# EAGLE schematic Rear Board v38 (EAGLE 9.7.0)
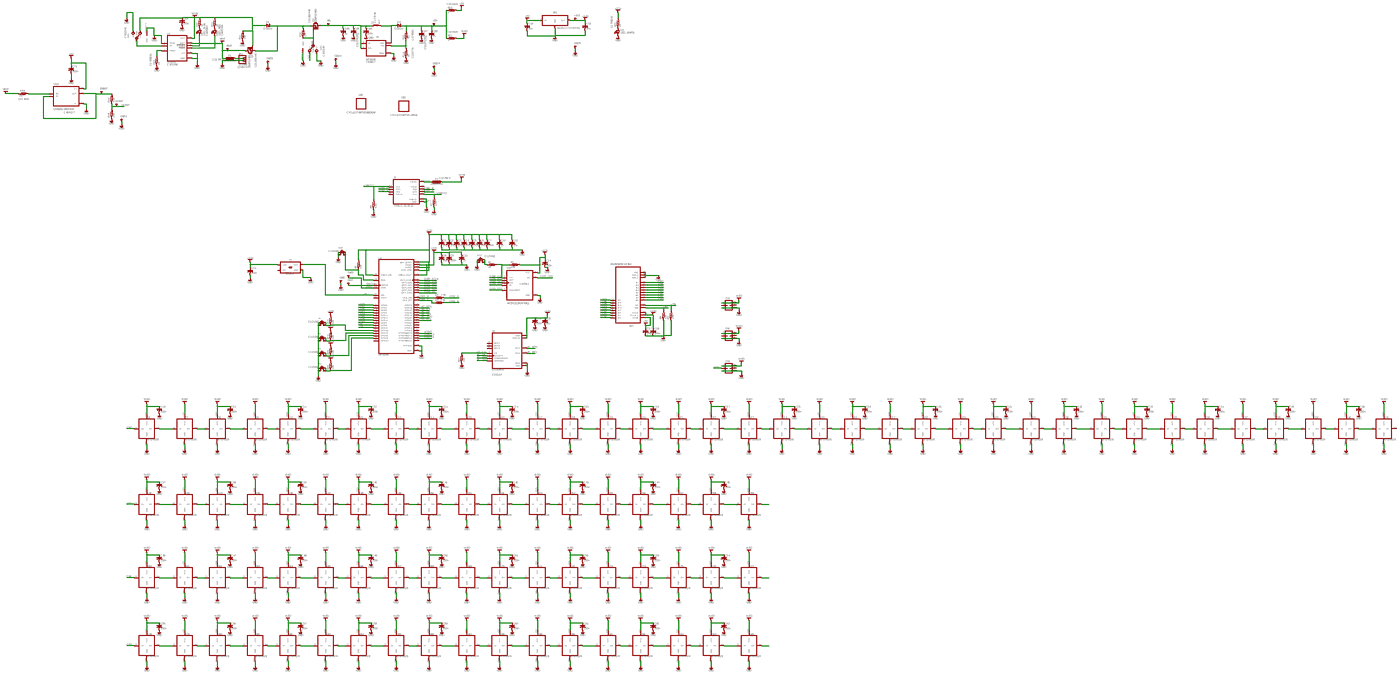
[diagram p0: schematic, sheet 1, overview]
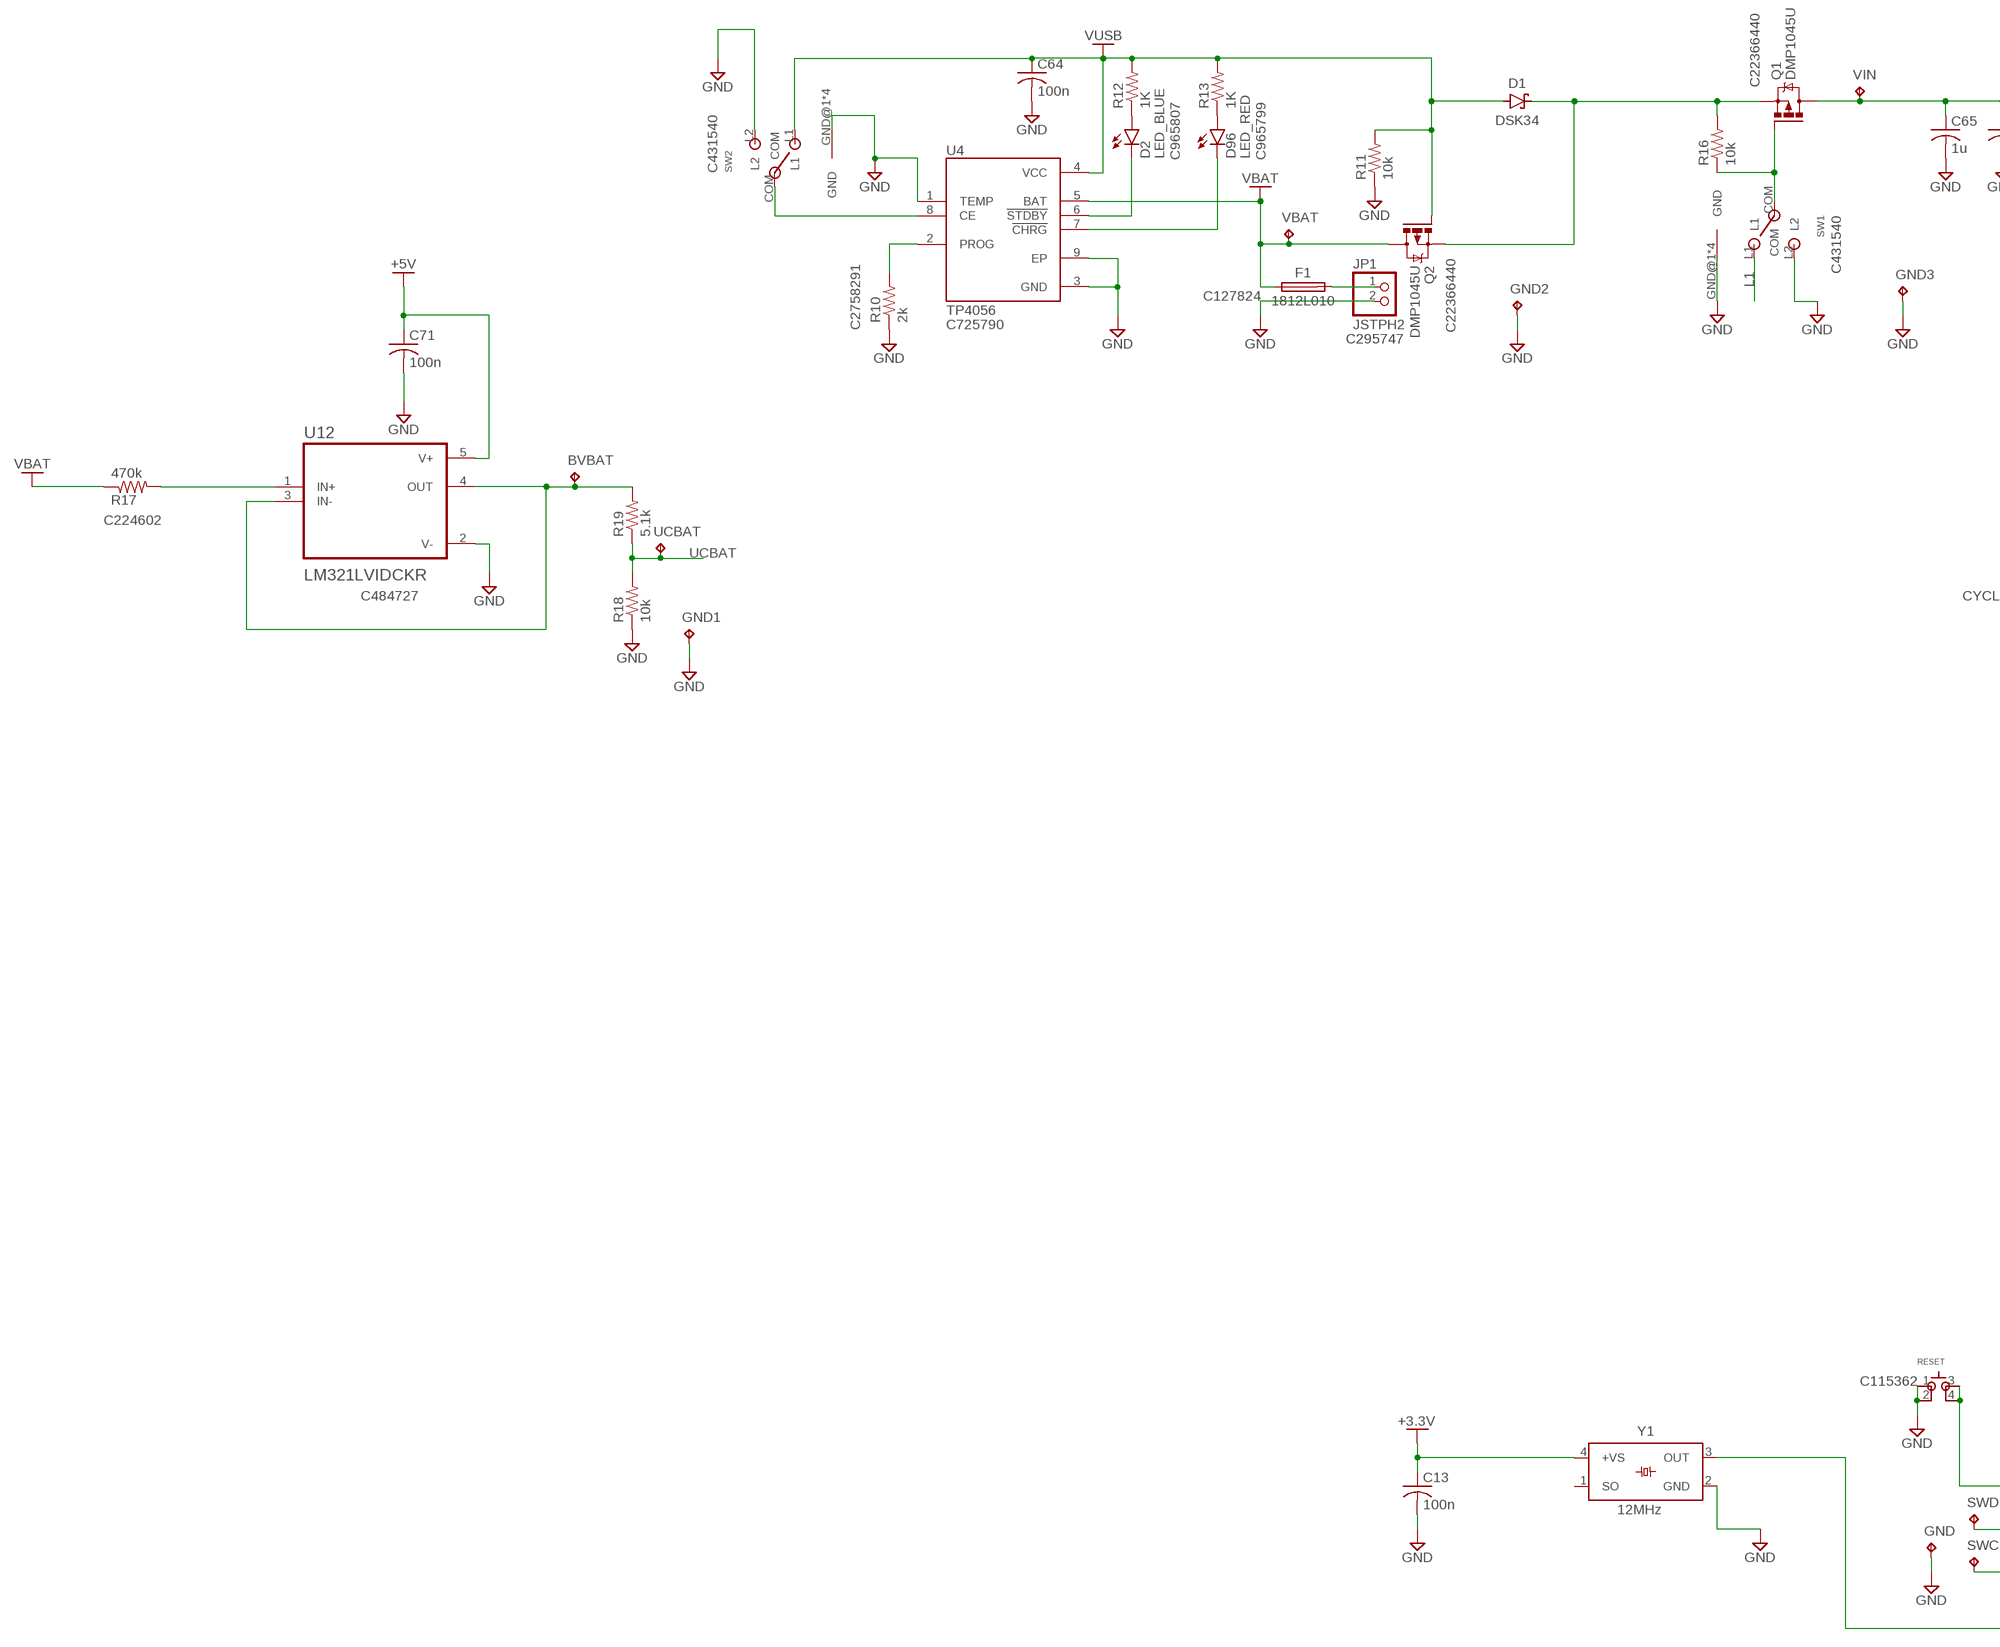
[diagram p1: schematic, sheet 1, part 1 of 6]
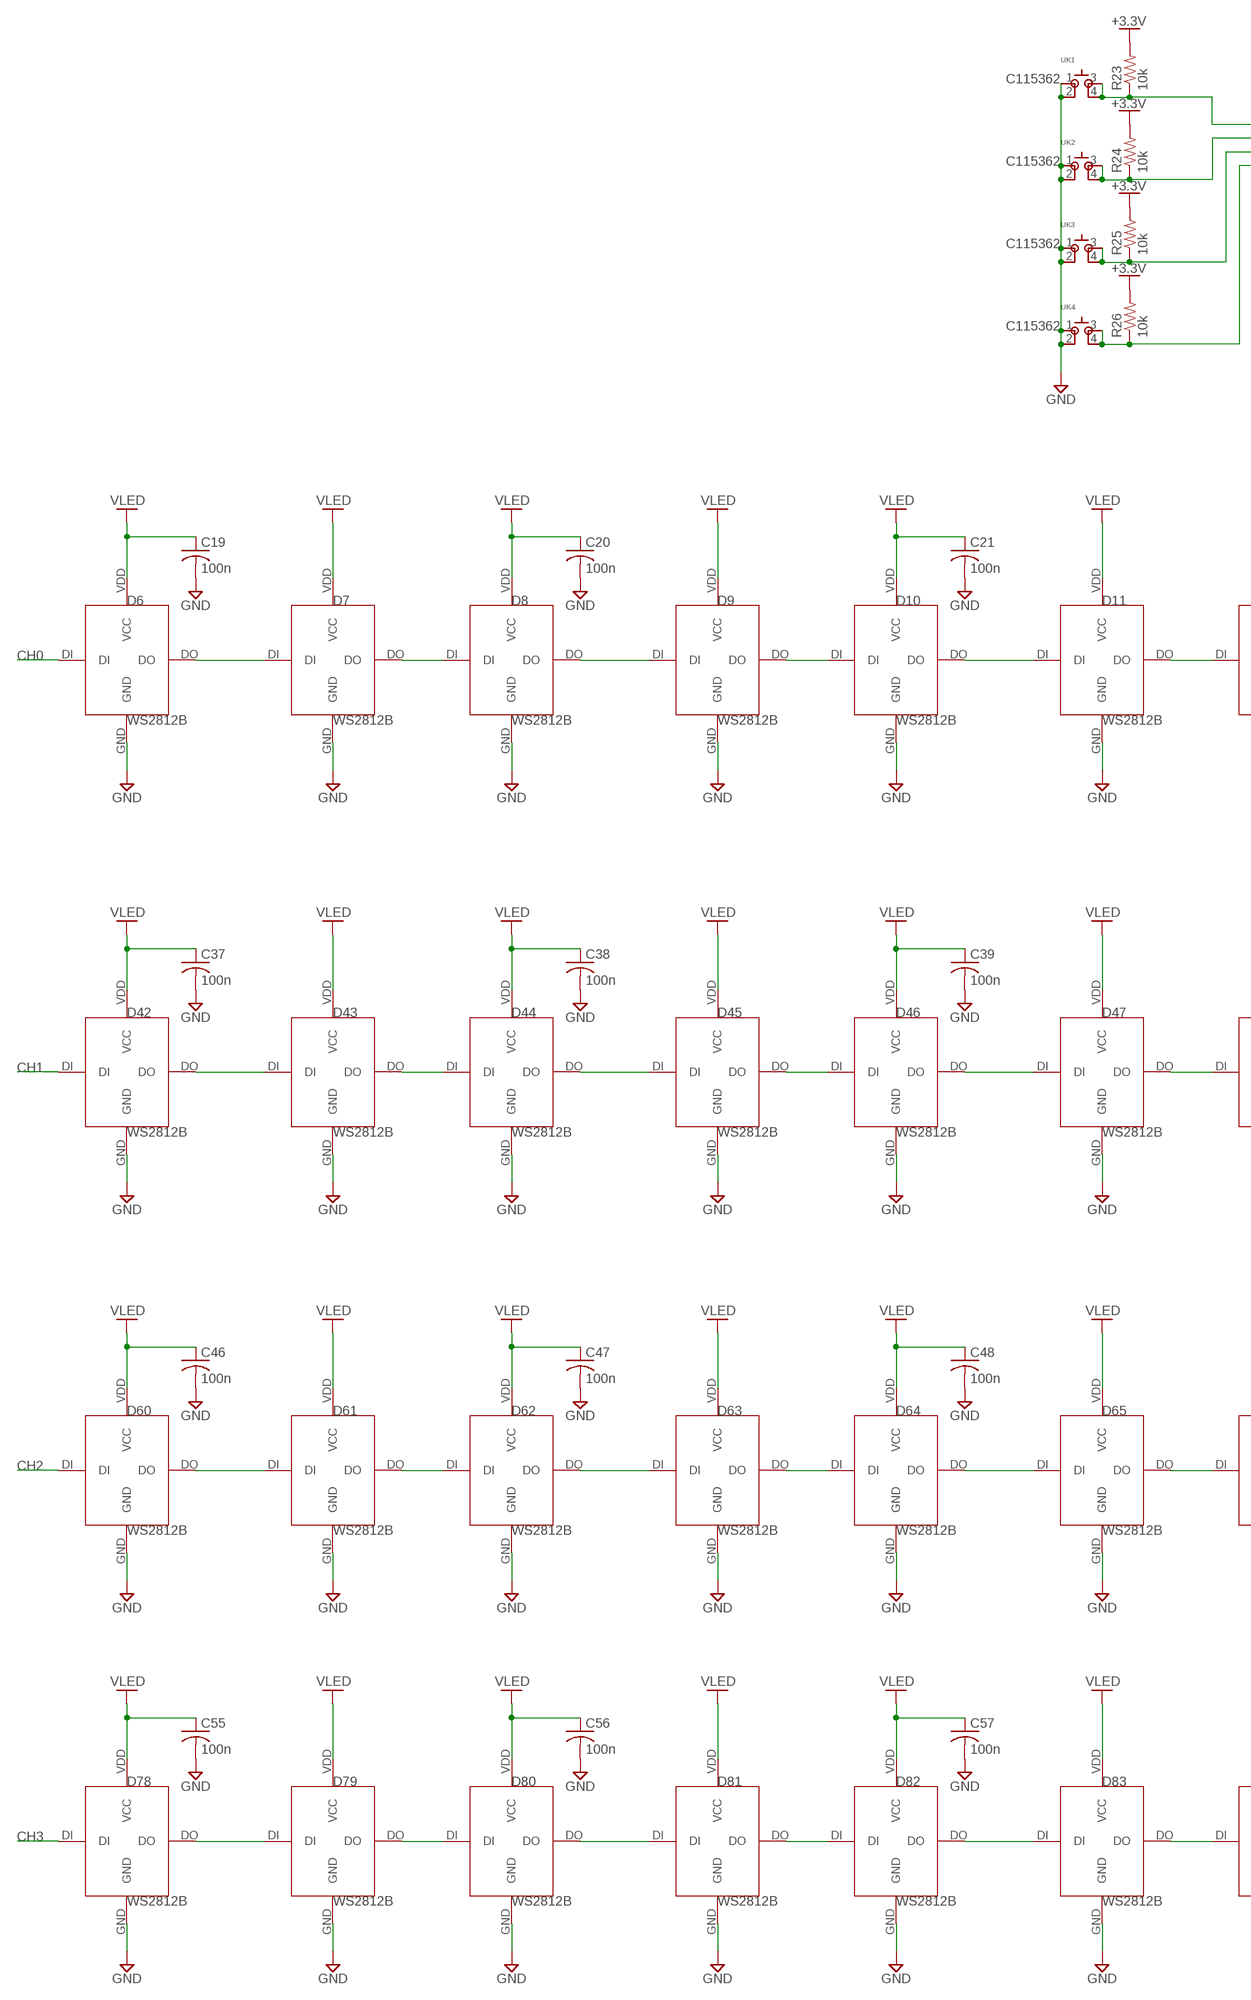
[diagram p2: schematic, sheet 1, part 2 of 6]
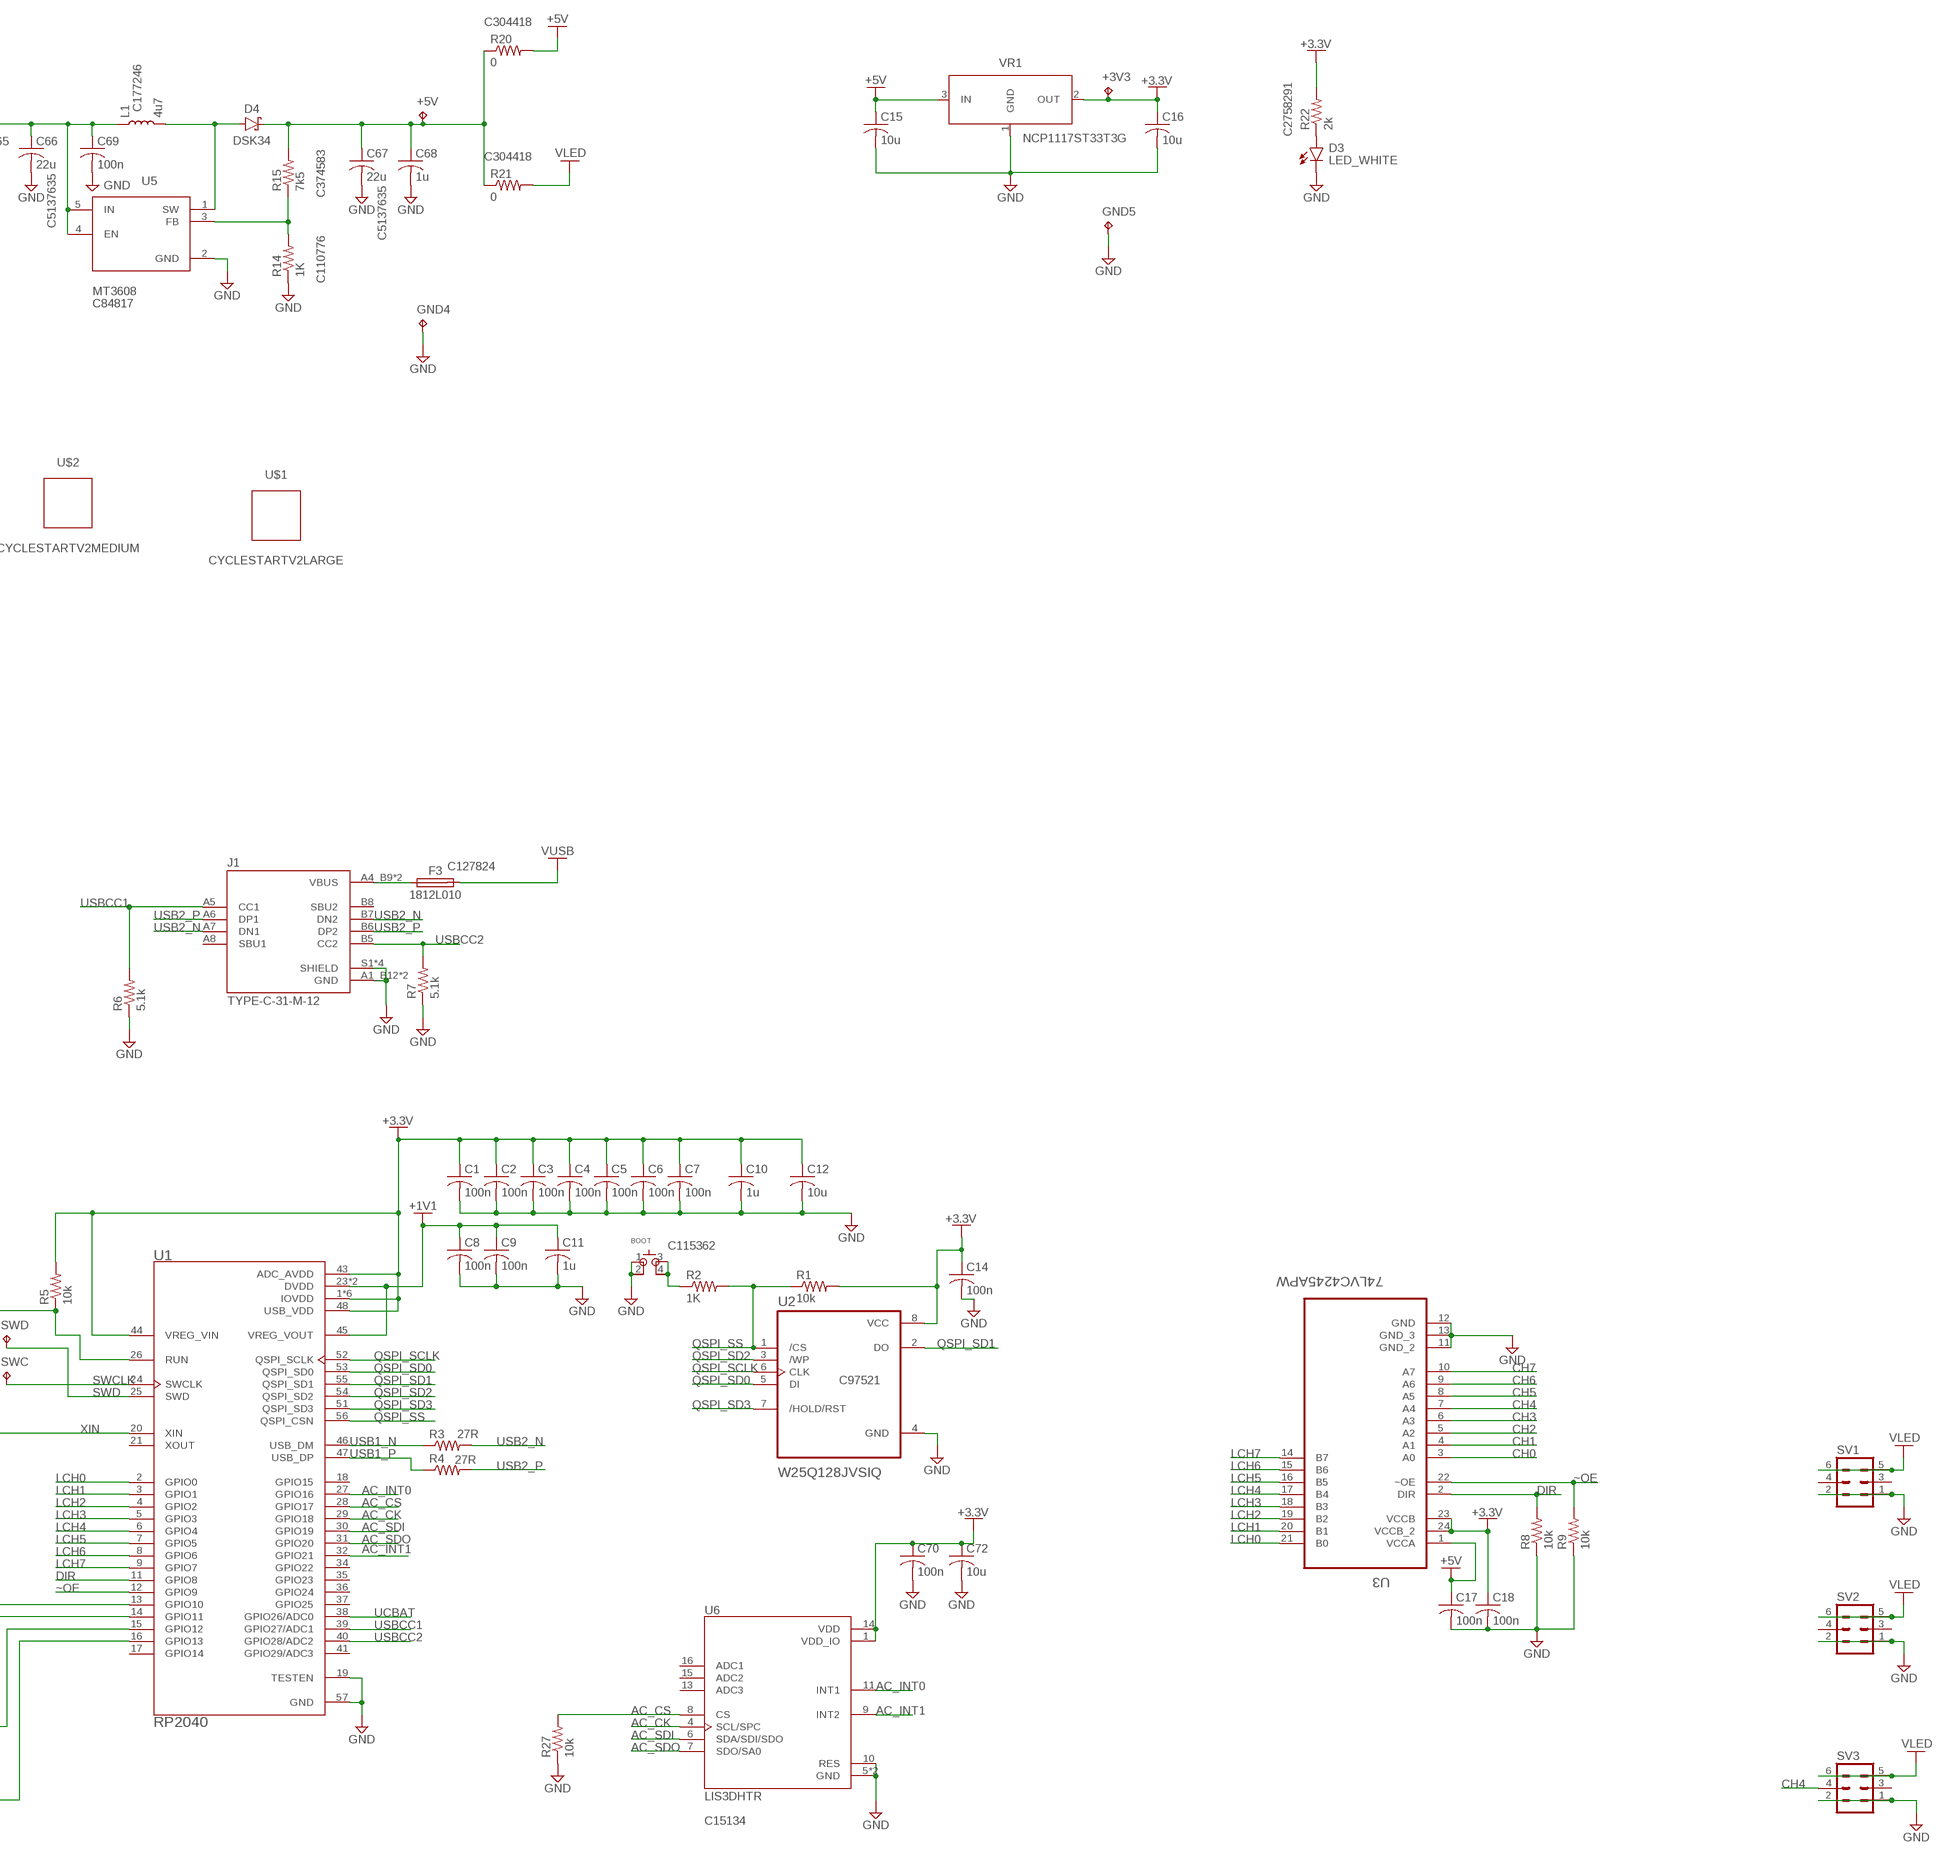
[diagram p3: schematic, sheet 1, part 3 of 6]
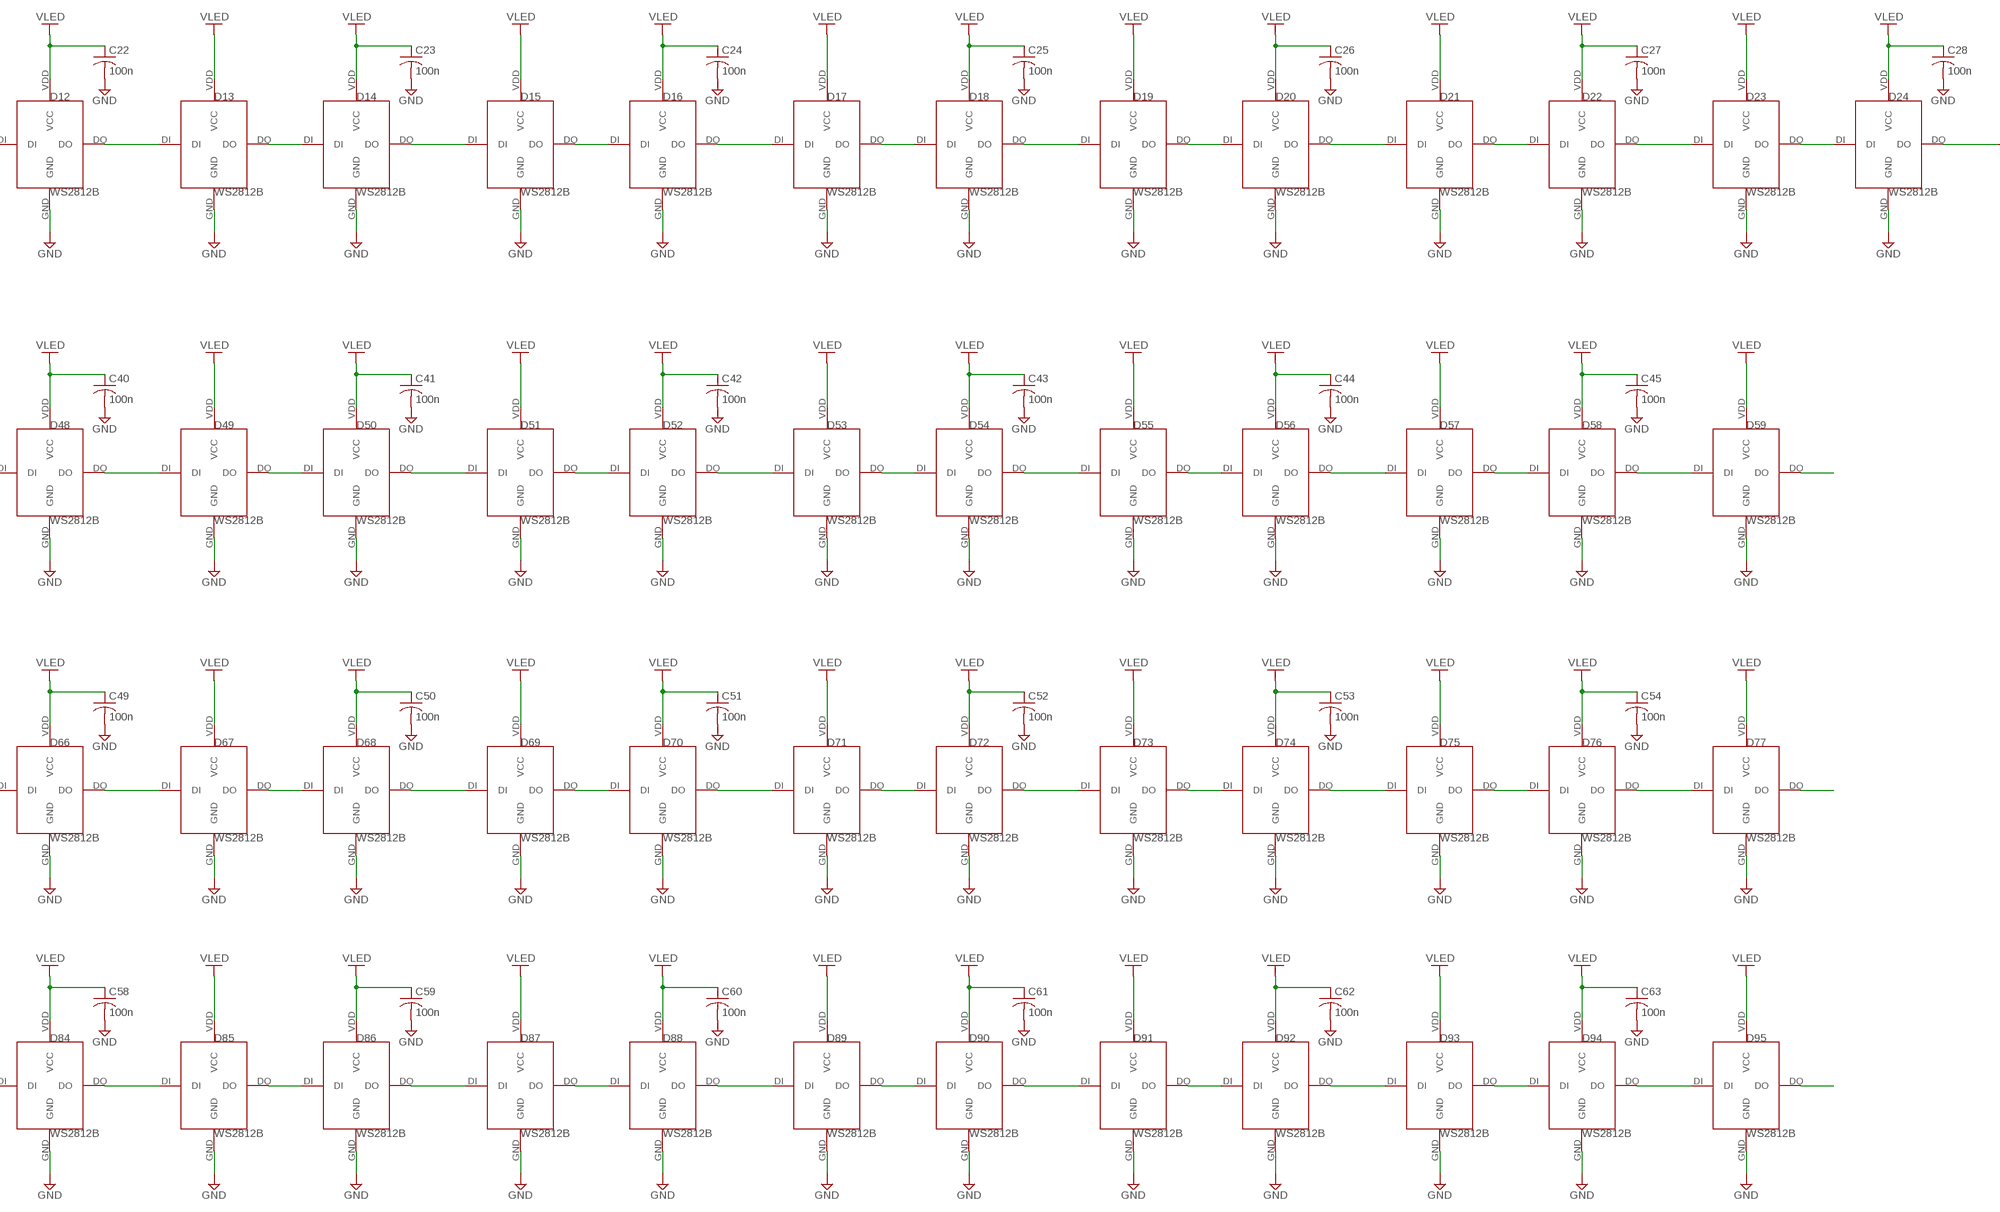
[diagram p4: schematic, sheet 1, part 4 of 6]
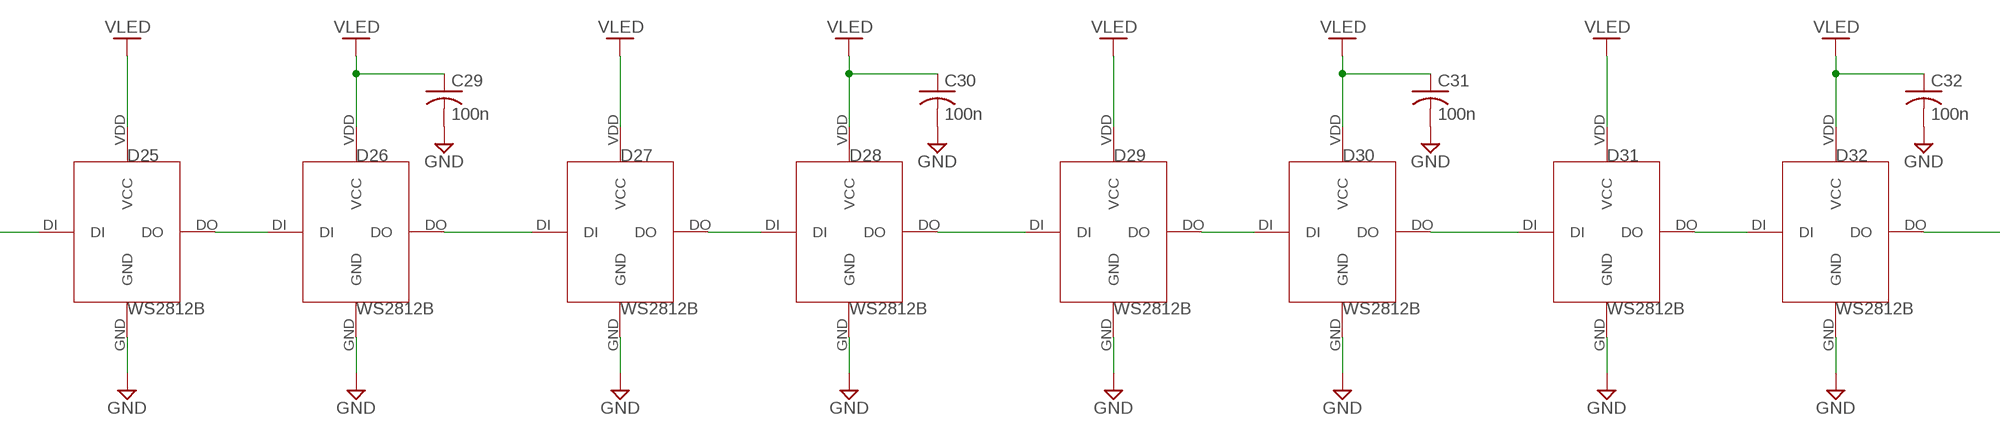
[diagram p5: schematic, sheet 1, part 5 of 6]
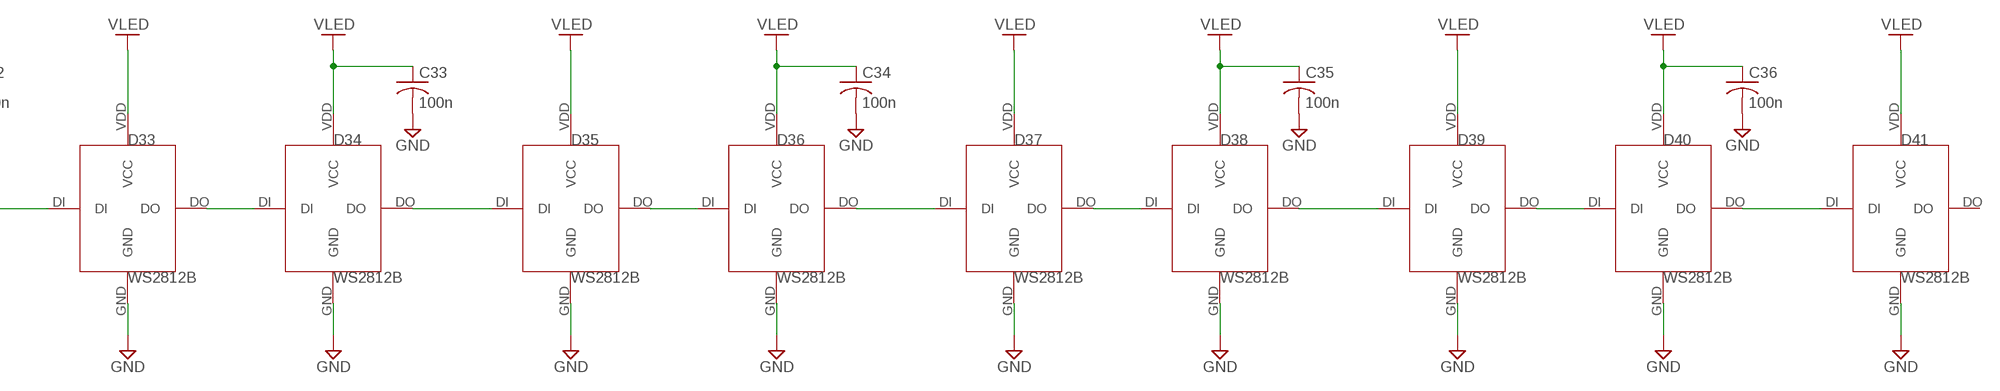
[diagram p6: schematic, sheet 1, part 6 of 6]

## Parts
+3V3  TPB2,54  [B2,54]
+5V  TPB2,54  [B2,54]
BOOT  SKSCLDE010  [SKSCLDE010]
BVBAT  TPB2,54  [B2,54]
C1  100n  C-USC0603  [C0603]
C2  100n  C-USC0603  [C0603]
C3  100n  C-USC0603  [C0603]
C4  100n  C-USC0603  [C0603]
C5  100n  C-USC0603  [C0603]
C6  100n  C-USC0603  [C0603]
C7  100n  C-USC0603  [C0603]
C8  100n  C-USC0603  [C0603]
C9  100n  C-USC0603  [C0603]
C10  1u  C-USC0603  [C0603]
C11  1u  C-USC0603  [C0603]
C12  10u  C-USC0603  [C0603]
C13  100n  C-USC0603  [C0603]
C14  100n  C-USC0603  [C0603]
C15  10u  C-USC0603  [C0603]
C16  10u  C-USC0603  [C0603]
C17  100n  C-USC0603  [C0603]
C18  100n  C-USC0603  [C0603]
C19  100n  C-USC0603K  [C0603K]
C20  100n  C-USC0603K  [C0603K]
C21  100n  C-USC0603K  [C0603K]
C22  100n  C-USC0603K  [C0603K]
C23  100n  C-USC0603K  [C0603K]
C24  100n  C-USC0603K  [C0603K]
C25  100n  C-USC0603K  [C0603K]
C26  100n  C-USC0603K  [C0603K]
C27  100n  C-USC0603K  [C0603K]
C28  100n  C-USC0603K  [C0603K]
C29  100n  C-USC0603K  [C0603K]
C30  100n  C-USC0603K  [C0603K]
C31  100n  C-USC0603K  [C0603K]
C32  100n  C-USC0603K  [C0603K]
C33  100n  C-USC0603K  [C0603K]
C34  100n  C-USC0603K  [C0603K]
C35  100n  C-USC0603K  [C0603K]
C36  100n  C-USC0603K  [C0603K]
C37  100n  C-USC0603K  [C0603K]
C38  100n  C-USC0603K  [C0603K]
C39  100n  C-USC0603K  [C0603K]
C40  100n  C-USC0603K  [C0603K]
C41  100n  C-USC0603K  [C0603K]
C42  100n  C-USC0603K  [C0603K]
C43  100n  C-USC0603K  [C0603K]
C44  100n  C-USC0603K  [C0603K]
C45  100n  C-USC0603K  [C0603K]
C46  100n  C-USC0603K  [C0603K]
C47  100n  C-USC0603K  [C0603K]
C48  100n  C-USC0603K  [C0603K]
C49  100n  C-USC0603K  [C0603K]
C50  100n  C-USC0603K  [C0603K]
C51  100n  C-USC0603K  [C0603K]
C52  100n  C-USC0603K  [C0603K]
C53  100n  C-USC0603K  [C0603K]
C54  100n  C-USC0603K  [C0603K]
C55  100n  C-USC0603K  [C0603K]
C56  100n  C-USC0603K  [C0603K]
C57  100n  C-USC0603K  [C0603K]
C58  100n  C-USC0603K  [C0603K]
C59  100n  C-USC0603K  [C0603K]
C60  100n  C-USC0603K  [C0603K]
C61  100n  C-USC0603K  [C0603K]
C62  100n  C-USC0603K  [C0603K]
C63  100n  C-USC0603K  [C0603K]
C64  100n  C-USC0603  [C0603]
C65  1u  C-USC0603  [C0603]
C66  22u  C-USC1206K  [C1206K]
C67  22u  C-USC1206K  [C1206K]
C68  1u  C-USC0603  [C0603]
C69  100n  C-USC0603  [C0603]
C70  100n  C-USC0603  [C0603]
C71  100n  C-USC0603  [C0603]
C72  10u  C-USC0603  [C0603]
D1  DSK34  SCHOTTKY_MBR0520LT1GDO-219  [SODFL3718X115]
D2  LED_BLUE  CHIP-FLAT-B_0603-0.35MM  [LEDC1608X35N_FLAT-B]
D3  LED_WHITE  CHIP-FLAT-B_0603-0.35MM  [LEDC1608X35N_FLAT-B]
D4  DSK34  SCHOTTKY_MBR0520LT1GDO-219  [SODFL3718X115]
D6  WS2812B  [1010]
D7  WS2812B  [1010]
D8  WS2812B  [1010]
D9  WS2812B  [1010]
D10  WS2812B  [1010]
D11  WS2812B  [1010]
D12  WS2812B  [1010]
D13  WS2812B  [1010]
D14  WS2812B  [1010]
D15  WS2812B  [1010]
D16  WS2812B  [1010]
D17  WS2812B  [1010]
D18  WS2812B  [1010]
D19  WS2812B  [1010]
D20  WS2812B  [1010]
D21  WS2812B  [1010]
D22  WS2812B  [1010]
D23  WS2812B  [1010]
D24  WS2812B  [1010]
D25  WS2812B  [1010]
D26  WS2812B  [1010]
D27  WS2812B  [1010]
D28  WS2812B  [1010]
D29  WS2812B  [1010]
D30  WS2812B  [1010]
D31  WS2812B  [1010]
D32  WS2812B  [1010]
D33  WS2812B  [1010]
D34  WS2812B  [1010]
D35  WS2812B  [1010]
D36  WS2812B  [1010]
D37  WS2812B  [1010]
D38  WS2812B  [1010]
D39  WS2812B  [1010]
D40  WS2812B  [1010]
D41  WS2812B  [1010]
D42  WS2812B  [1010]
D43  WS2812B  [1010]
D44  WS2812B  [1010]
D45  WS2812B  [1010]
D46  WS2812B  [1010]
D47  WS2812B  [1010]
D48  WS2812B  [1010]
D49  WS2812B  [1010]
D50  WS2812B  [1010]
D51  WS2812B  [1010]
D52  WS2812B  [1010]
D53  WS2812B  [1010]
D54  WS2812B  [1010]
D55  WS2812B  [1010]
D56  WS2812B  [1010]
D57  WS2812B  [1010]
D58  WS2812B  [1010]
D59  WS2812B  [1010]
D60  WS2812B  [1010]
D61  WS2812B  [1010]
D62  WS2812B  [1010]
D63  WS2812B  [1010]
D64  WS2812B  [1010]
D65  WS2812B  [1010]
D66  WS2812B  [1010]
D67  WS2812B  [1010]
D68  WS2812B  [1010]
D69  WS2812B  [1010]
D70  WS2812B  [1010]
D71  WS2812B  [1010]
D72  WS2812B  [1010]
D73  WS2812B  [1010]
D74  WS2812B  [1010]
D75  WS2812B  [1010]
D76  WS2812B  [1010]
D77  WS2812B  [1010]
D78  WS2812B  [1010]
D79  WS2812B  [1010]
D80  WS2812B  [1010]
D81  WS2812B  [1010]
D82  WS2812B  [1010]
D83  WS2812B  [1010]
D84  WS2812B  [1010]
D85  WS2812B  [1010]
D86  WS2812B  [1010]
D87  WS2812B  [1010]
D88  WS2812B  [1010]
D89  WS2812B  [1010]
D90  WS2812B  [1010]
D91  WS2812B  [1010]
D92  WS2812B  [1010]
D93  WS2812B  [1010]
D94  WS2812B  [1010]
D95  WS2812B  [1010]
D96  LED_RED  CHIP-FLAT-B_0603-0.35MM  [LEDC1608X35N_FLAT-B]
F1  1812L010  [FUSC4532X125]
F3  1812L010  [FUSC4532X125]
GND  TPB2,54  [B2,54]
GND1  TPB2,54  [B2,54]
GND2  TPB2,54  [B2,54]
GND3  TPB2,54  [B2,54]
GND4  TPB2,54  [B2,54]
GND5  TPB2,54  [B2,54]
J1  TYPE-C-31-M-12  [HRO_TYPE-C-31-M-12]
JP1  JSTPH2  [JSTPH2]
L1  4u7  2.2μH_SHIELDED_INDUCTOR_5X5  [INDUCTOR_5X5MM]
Q1  DMP1045U  PMOSFET_IRLML5203_SOT23-GSD  [SOT23]
Q2  DMP1045U  PMOSFET_IRLML5203_SOT23-GSD  [SOT23]
R1  10k  R-US_R0603  [R0603]
R2  1K  R-US_R0603  [R0603]
R3  27R  R-US_R0603  [R0603]
R4  27R  R-US_R0603  [R0603]
R5  10k  R-US_R0603  [R0603]
R6  5.1k  R-US_R0603  [R0603]
R7  5.1k  R-US_R0603  [R0603]
R8  10k  R-US_R0603  [R0603]
R9  10k  R-US_R0603  [R0603]
R10  2k  R-US_R0603  [R0603]
R11  10k  R-US_R0603  [R0603]
R12  1K  R-US_R0603  [R0603]
R13  1K  R-US_R0603  [R0603]
R14  1K  R-US_R0603  [R0603]
R15  7k5  R-US_R0603  [R0603]
R16  10k  R-US_R0603  [R0603]
R17  470k  R-US_R0603  [R0603]
R18  10k  R-US_R0603  [R0603]
R19  5.1k  R-US_R0603  [R0603]
R20  0  R-US_R1206  [R1206]
R21  0  R-US_R1206  [R1206]
R22  2k  R-US_R0603  [R0603]
R23  10k  R-US_R0603  [R0603]
R24  10k  R-US_R0603  [R0603]
R25  10k  R-US_R0603  [R0603]
R26  10k  R-US_R0603  [R0603]
R27  10k  R-US_R0603  [R0603]
RESET  SKSCLDE010  [SKSCLDE010]
SV1  MA03-2  [MA03-2]
SV2  MA03-2  [MA03-2]
SV3  MA03-2  [MA03-2]
SW1  MSK-12C02_SMD_SPDT_SWITCH  [MSK-12C02]
SW2  MSK-12C02_SMD_SPDT_SWITCH  [MSK-12C02]
SWC  TPB2,54  [B2,54]
SWD  TPB2,54  [B2,54]
U1  RP2040  [QFN40P700X700X90-57N]
U2  W25Q128JVSIQ  W25Q64JVSSIQ  [SOIC127P790X216-8N]
U3  74LVC4245APW  [SOP65P640X110-24N]
U4  TP4056  [SOP127P600X175-9N]
U5  MT3608  [SOT95P280X145-6N]
U6  LIS3DHTR  [XDCR_LIS3DHTR]
U12  LM321LVIDCKR  [SOT65P210X110-5N]
U$1  CYCLESTARTV2LARGE  [CYCLESTARTV2LARGE]
U$2  CYCLESTARTV2MEDIUM  [CYCLESTARTV2MEDIUM]
UCBAT  TPB2,54  [B2,54]
UK1  SKSCLDE010  [SKSCLDE010]
UK2  SKSCLDE010  [SKSCLDE010]
UK3  SKSCLDE010  [SKSCLDE010]
UK4  SKSCLDE010  [SKSCLDE010]
VBAT  TPB2,54  [B2,54]
VIN  TPB2,54  [B2,54]
VR1  NCP1117ST33T3G  NCP1117ST33T3GSOT-223  [SOT230P700X170-4]
Y1  12MHz  WE-SPXO_IQXO-540_830208214609  [WE-SPXO_IQXO-540]

## Nets
+1V1: C8.1 C9.1 C11.1 U1.23(DVDD) U1.45(VREG_VOUT) U1.50(DVDD)
+3.3V: +3V3.TP C1.1 C2.1 C3.1 C4.1 C5.1 C6.1 C7.1 C10.1 C12.1 C13.1 C14.1 C16.1 C18.1 C70.1 C72.1 R1.2 R5.2 R22.2 R23.2 R24.2 R25.2 R26.2 U1.1(IOVDD) U1.10(IOVDD) U1.22(IOVDD) U1.33(IOVDD) U1.42(IOVDD) U1.43(ADC_AVDD) U1.44(VREG_VIN) U1.48(USB_VDD) U1.49(IOVDD) U2.8(VCC) U3.23(VCCB) U3.24(VCCB_2) U6.1(VDD_IO) U6.14(VDD) VR1.2(OUT) Y1.4(+VS)
+5V: C15.1 C17.1 C71.1 R20.2 U3.1(VCCA) U12.5(V+) VR1.3(IN)
AC_CK: U1.29(GPIO18) U6.4(SCL/SPC)
AC_CS: R27.2 U1.28(GPIO17) U6.8(CS)
AC_INT0: U1.27(GPIO16) U6.11(INT1)
AC_INT1: U1.32(GPIO21) U6.9(INT2)
AC_SDI: U1.30(GPIO19) U6.6(SDA/SDI/SDO)
AC_SDO: U1.31(GPIO20) U6.7(SDO/SA0)
AMP7: BVBAT.TP R19.2 U12.3(IN-) U12.4(OUT)
CH0: D6.DI U3.3(A0)
CH1: D42.DI U3.4(A1)
CH2: D60.DI U3.5(A2)
CH3: D78.DI U3.6(A3)
CH4: SV3.4 U3.7(A4)
CH5: U3.8(A5)
CH6: U3.9(A6)
CH7: U3.10(A7)
DIR: R8.2 U1.11(GPIO8) U3.2(DIR)
GND: BOOT.1 BOOT.2 C1.2 C2.2 C3.2 C4.2 C5.2 C6.2 C7.2 C8.2 C9.2 C10.2 C11.2 C12.2 C13.2 C14.2 C15.2 C16.2 C17.2 C18.2 C19.2 C20.2 C21.2 C22.2 C23.2 C24.2 C25.2 C26.2 C27.2 C28.2 C29.2 C30.2 C31.2 C32.2 C33.2 C34.2 C35.2 C36.2 C37.2 C38.2 C39.2 C40.2 C41.2 C42.2 C43.2 C44.2 C45.2 C46.2 C47.2 C48.2 C49.2 C50.2 C51.2 C52.2 C53.2 C54.2 C55.2 C56.2 C57.2 C58.2 C59.2 C60.2 C61.2 C62.2 C63.2 C64.2 C65.2 C66.2 C67.2 C68.2 C69.2 C70.2 C71.2 C72.2 D3.C D6.GND D7.GND D8.GND D9.GND D10.GND D11.GND D12.GND D13.GND D14.GND D15.GND D16.GND D17.GND D18.GND D19.GND D20.GND D21.GND D22.GND D23.GND D24.GND D25.GND D26.GND D27.GND D28.GND D29.GND D30.GND D31.GND D32.GND D33.GND D34.GND D35.GND D36.GND D37.GND D38.GND D39.GND D40.GND D41.GND D42.GND D43.GND D44.GND D45.GND D46.GND D47.GND D48.GND D49.GND D50.GND D51.GND D52.GND D53.GND D54.GND D55.GND D56.GND D57.GND D58.GND D59.GND D60.GND D61.GND D62.GND D63.GND D64.GND D65.GND D66.GND D67.GND D68.GND D69.GND D70.GND D71.GND D72.GND D73.GND D74.GND D75.GND D76.GND D77.GND D78.GND D79.GND D80.GND D81.GND D82.GND D83.GND D84.GND D85.GND D86.GND D87.GND D88.GND D89.GND D90.GND D91.GND D92.GND D93.GND D94.GND D95.GND GND1.TP GND2.TP GND3.TP GND4.TP GND5.TP GND.TP J1.A1_B12(GND) J1.B1_A12(GND) J1.S1(SHIELD) J1.S2(SHIELD) J1.S3(SHIELD) J1.S4(SHIELD) JP1.2 R6.1 R7.1 R8.1 R9.1 R10.1 R11.1 R14.1 R18.1 R27.1 RESET.1 RESET.2 SV1.1 SV1.2 SV2.1 SV2.2 SV3.1 SV3.2 SW1.GND@1(GND) SW1.GND@2(GND) SW1.GND@3(GND) SW1.GND@4(GND) SW1.L2 SW2.GND@1(GND) SW2.GND@2(GND) SW2.GND@3(GND) SW2.GND@4(GND) SW2.L2 U1.19(TESTEN) U1.57(GND) U2.4(GND) U3.11(GND_2) U3.12(GND) U3.13(GND_3) U4.1(TEMP) U4.3(GND) U4.9(EP) U5.2(GND) U6.5(GND) U6.10(RES) U6.12(GND) U12.2(V-) UK1.1 UK1.2 UK2.1 UK2.2 UK3.1 UK3.2 UK4.1 UK4.2 VR1.1(GND) Y1.2(GND)
L1: SW1.L1
LCH0: U1.2(GPIO0) U3.21(B0)
LCH1: U1.3(GPIO1) U3.20(B1)
LCH2: U1.4(GPIO2) U3.19(B2)
LCH3: U1.5(GPIO3) U3.18(B3)
LCH4: U1.6(GPIO4) U3.17(B4)
LCH5: U1.7(GPIO5) U3.16(B5)
LCH6: U1.8(GPIO6) U3.15(B6)
LCH7: U1.9(GPIO7) U3.14(B7)
N$1: D3.A R22.1
N$2: D6.DO D7.DI
N$3: BOOT.3 BOOT.4 R2.1
N$4: D7.DO D8.DI
N$5: R5.1 RESET.3 RESET.4 U1.26(RUN)
N$6: D8.DO D9.DI
N$7: D9.DO D10.DI
N$8: D10.DO D11.DI
N$9: D11.DO D12.DI
N$10: D12.DO D13.DI
N$11: D13.DO D14.DI
N$12: D14.DO D15.DI
N$13: D15.DO D16.DI
N$14: D16.DO D17.DI
N$15: D17.DO D18.DI
N$16: D18.DO D19.DI
N$17: F3.1 J1.A4_B9(VBUS) J1.B4_A9(VBUS)
N$18: D19.DO D20.DI
N$19: D20.DO D21.DI
N$20: R23.1 U1.13(GPIO10) UK1.3 UK1.4
N$21: D21.DO D22.DI
N$22: D22.DO D23.DI
N$23: D23.DO D24.DI
N$24: D24.DO D25.DI
N$25: D25.DO D26.DI
N$26: D26.DO D27.DI
N$27: D27.DO D28.DI
N$28: D28.DO D29.DI
N$29: D29.DO D30.DI
N$30: D30.DO D31.DI
N$31: D31.DO D32.DI
N$32: D32.DO D33.DI
N$33: D33.DO D34.DI
N$34: D34.DO D35.DI
N$35: D35.DO D36.DI
N$36: D36.DO D37.DI
N$37: D37.DO D38.DI
N$38: D42.DO D43.DI
N$39: D38.DO D39.DI
N$40: D39.DO D40.DI
N$41: D40.DO D41.DI
N$42: D43.DO D44.DI
N$43: D44.DO D45.DI
N$44: D45.DO D46.DI
N$45: D46.DO D47.DI
N$46: D47.DO D48.DI
N$47: D48.DO D49.DI
N$48: D49.DO D50.DI
N$49: D50.DO D51.DI
N$50: D51.DO D52.DI
N$51: D52.DO D53.DI
N$52: D53.DO D54.DI
N$53: D54.DO D55.DI
N$54: D55.DO D56.DI
N$55: D56.DO D57.DI
N$56: D57.DO D58.DI
N$57: D60.DO D61.DI
N$58: D58.DO D59.DI
N$59: D59.DO
N$60: D61.DO D62.DI
N$61: D62.DO D63.DI
N$62: D63.DO D64.DI
N$63: D64.DO D65.DI
N$64: D65.DO D66.DI
N$65: D66.DO D67.DI
N$66: D67.DO D68.DI
N$67: D68.DO D69.DI
N$68: D69.DO D70.DI
N$69: D70.DO D71.DI
N$70: D71.DO D72.DI
N$71: D72.DO D73.DI
N$72: D73.DO D74.DI
N$73: D74.DO D75.DI
N$74: D75.DO D76.DI
N$75: D76.DO D77.DI
N$76: D77.DO
N$77: D78.DO D79.DI
N$78: D79.DO D80.DI
N$79: D80.DO D81.DI
N$80: D81.DO D82.DI
N$81: D82.DO D83.DI
N$82: D83.DO D84.DI
N$83: D84.DO D85.DI
N$84: D85.DO D86.DI
N$85: D86.DO D87.DI
N$86: D87.DO D88.DI
N$87: D88.DO D89.DI
N$88: D89.DO D90.DI
N$89: D90.DO D91.DI
N$90: D91.DO D92.DI
N$91: D92.DO D93.DI
N$92: D93.DO D94.DI
N$93: D94.DO D95.DI
N$94: D95.DO
N$95: F1.2 JP1.1
N$96: R10.2 U4.2(PROG)
N$97: D96.A R13.1
N$98: D1.1(C) Q1.2(S) Q2.2(S) R16.2
N$99: D2.A R12.1
N$100: D96.C U4.7(!CHRG)
N$101: D2.C U4.6(!STDBY)
N$102: C65.1 C66.1 C69.1 L1.P$1 Q1.3(D) U5.4(EN) U5.5(IN) VIN.TP
N$103: D4.2(A) L1.P$2 U5.1(SW)
N$104: +5V.TP C67.1 C68.1 D4.1(C) R15.2 R20.1 R21.1
N$105: R14.2 R15.1 U5.3(FB)
N$106: Q1.1(G) R16.1 SW1.COM
N$107: R17.2 U12.1(IN+)
N$108: R24.1 U1.14(GPIO11) UK2.3 UK2.4
N$109: R25.1 U1.15(GPIO12) UK3.3 UK3.4
N$110: R26.1 U1.16(GPIO13) UK4.3 UK4.4
N$111: SW2.COM U4.8(CE)
QSPI_SCLK: U1.52(QSPI_SCLK) U2.6(CLK)
QSPI_SD0: U1.53(QSPI_SD0) U2.5(DI)
QSPI_SD1: U1.55(QSPI_SD1) U2.2(DO)
QSPI_SD2: U1.54(QSPI_SD2) U2.3(/WP)
QSPI_SD3: U1.51(QSPI_SD3) U2.7(/HOLD/RST)
QSPI_SS: R1.1 R2.2 U1.56(QSPI_CSN) U2.1(/CS)
SWCLK: SWC.TP U1.24(SWCLK)
SWD: SWD.TP U1.25(SWD)
UCBAT: R18.2 R19.1 U1.38(GPIO26/ADC0) UCBAT.TP
USB1_N: R3.1 U1.46(USB_DM)
USB1_P: R4.1 U1.47(USB_DP)
USB2_N: J1.A7(DN1) J1.B7(DN2) R3.2
USB2_P: J1.A6(DP1) J1.B6(DP2) R4.2
USBCC1: J1.A5(CC1) R6.2 U1.39(GPIO27/ADC1)
USBCC2: J1.B5(CC2) R7.2 U1.40(GPIO28/ADC2)
VBAT: F1.1 Q2.3(D) R17.1 U4.5(BAT) VBAT.TP
VLED: C19.1 C20.1 C21.1 C22.1 C23.1 C24.1 C25.1 C26.1 C27.1 C28.1 C29.1 C30.1 C31.1 C32.1 C33.1 C34.1 C35.1 C36.1 C37.1 C38.1 C39.1 C40.1 C41.1 C42.1 C43.1 C44.1 C45.1 C46.1 C47.1 C48.1 C49.1 C50.1 C51.1 C52.1 C53.1 C54.1 C55.1 C56.1 C57.1 C58.1 C59.1 C60.1 C61.1 C62.1 C63.1 D6.VDD(VCC) D7.VDD(VCC) D8.VDD(VCC) D9.VDD(VCC) D10.VDD(VCC) D11.VDD(VCC) D12.VDD(VCC) D13.VDD(VCC) D14.VDD(VCC) D15.VDD(VCC) D16.VDD(VCC) D17.VDD(VCC) D18.VDD(VCC) D19.VDD(VCC) D20.VDD(VCC) D21.VDD(VCC) D22.VDD(VCC) D23.VDD(VCC) D24.VDD(VCC) D25.VDD(VCC) D26.VDD(VCC) D27.VDD(VCC) D28.VDD(VCC) D29.VDD(VCC) D30.VDD(VCC) D31.VDD(VCC) D32.VDD(VCC) D33.VDD(VCC) D34.VDD(VCC) D35.VDD(VCC) D36.VDD(VCC) D37.VDD(VCC) D38.VDD(VCC) D39.VDD(VCC) D40.VDD(VCC) D41.VDD(VCC) D42.VDD(VCC) D43.VDD(VCC) D44.VDD(VCC) D45.VDD(VCC) D46.VDD(VCC) D47.VDD(VCC) D48.VDD(VCC) D49.VDD(VCC) D50.VDD(VCC) D51.VDD(VCC) D52.VDD(VCC) D53.VDD(VCC) D54.VDD(VCC) D55.VDD(VCC) D56.VDD(VCC) D57.VDD(VCC) D58.VDD(VCC) D59.VDD(VCC) D60.VDD(VCC) D61.VDD(VCC) D62.VDD(VCC) D63.VDD(VCC) D64.VDD(VCC) D65.VDD(VCC) D66.VDD(VCC) D67.VDD(VCC) D68.VDD(VCC) D69.VDD(VCC) D70.VDD(VCC) D71.VDD(VCC) D72.VDD(VCC) D73.VDD(VCC) D74.VDD(VCC) D75.VDD(VCC) D76.VDD(VCC) D77.VDD(VCC) D78.VDD(VCC) D79.VDD(VCC) D80.VDD(VCC) D81.VDD(VCC) D82.VDD(VCC) D83.VDD(VCC) D84.VDD(VCC) D85.VDD(VCC) D86.VDD(VCC) D87.VDD(VCC) D88.VDD(VCC) D89.VDD(VCC) D90.VDD(VCC) D91.VDD(VCC) D92.VDD(VCC) D93.VDD(VCC) D94.VDD(VCC) D95.VDD(VCC) R21.2 SV1.5 SV1.6 SV2.5 SV2.6 SV3.5 SV3.6
VUSB: C64.1 D1.2(A) F3.2 Q2.1(G) R11.2 R12.2 R13.2 SW2.L1 U4.4(VCC)
XIN: U1.20(XIN) Y1.3(OUT)
~OE: R9.2 U1.12(GPIO9) U3.22(~OE)
Unconnected: D41.DO J1.A8(SBU1) J1.B8(SBU2) SV1.3 SV1.4 SV2.3 SV2.4 SV3.3 U1.17(GPIO14) U1.18(GPIO15) U1.21(XOUT) U1.34(GPIO22) U1.35(GPIO23) U1.36(GPIO24) U1.37(GPIO25) U1.41(GPIO29/ADC3) U6.13(ADC3) U6.15(ADC2) U6.16(ADC1) Y1.1(SO)

## Library data of the parts
+3V3 +5V BVBAT GND GND1-GND5 SWC SWD UCBAT VBAT VIN = testpad:TP: Test pad
BOOT RESET UK1-UK4 = alps:SKSCLDE010; JLCPN: C115362
C1-C65 C68-C72 = rcl:C-US: CAPACITOR, American symbol; SPICEPREFIX: C
C66 C67 = rcl:C-US: CAPACITOR, American symbol; JLCPN: C5137635; SPICEPREFIX: C
D1 D4 = diode:SCHOTTKY_: Schottky Diode - Popular parts; CATEGORY: Diode; DESCRIPTION: DIODE SCHOTTKY 20V 500MA SOD123; MANUFACTURER: KUU; MPN: DSK34; SUB-CATEGORY: Schottky; VALUE: MBR0520LT1G
D2 = LED:CHIP-FLAT-B; CATEGORY: LED; COLOR: BLUE; DESCRIPTION: CHIP LED FLAT; JLCPN: C965807; SUB-CATEGORY: CHIP; TYPE: FLAT_TOP
D3 = LED:CHIP-FLAT-B; CATEGORY: LED; COLOR: BLUE; DESCRIPTION: CHIP LED FLAT; SUB-CATEGORY: CHIP; TYPE: FLAT_TOP; VALUE: LED_BLUE
D6-D95 = SnapEDA Library:WS2812B
D96 = LED:CHIP-FLAT-B; CATEGORY: LED; COLOR: BLUE; DESCRIPTION: CHIP LED FLAT; JLCPN: C965799; SUB-CATEGORY: CHIP; TYPE: FLAT_TOP; VALUE: LED_BLUE
F1 F3 = Fuse:1812L: 1812L Series PTC provides surface mount overcurrent protection for applications where resettable protection is desired. Datasheet <https://www.littelfuse.com/~/media/electronics/datasheets/resettable_ptcs/littelfuse_ptc_1812l_datasheet.pdf.pdf>; CATEGORY: FUSE; DESCRIPTION: Resettable PTCs; JLCPN: C127824; MANUFACTURER: Littlefuse; MPN: 1812L010; OPERATING_TEMPERATURE: -40°C to +85°C; PART_STATUS: ACTIVE; ROHS_COMPLIANCE: RoHS Compliant; SERIES: 1812L; SUBCATEGORY: Resettable; TYPE: PTC
J1 = SnapEDA Library:TYPE-C-31-M-12; MANUFACTURER: HRO Electronics Co., Ltd.; MAXIMUM_PACKAGE_HEIGHT: 3.26 mm; PARTREV: 2020.12.08; SNAPEDA_PN: TYPE-C-31-M-12; STANDARD: Manufacturer Recommendations
JP1 = Tutorial - Fusion 360:JSTPH2; JLCPN: C295747
L1 = SparkFun-Coils:2.2μH_SHIELDED_INDUCTOR: Murata 2.2uH Inductor 2.2uH 1.2A 110mOhm 0806 Package Shielded Bourns 2.2uH Inductor 2.2uH 5.5A 205mOhm 5x5mm Package Shielded; JLCPN: C177246; PROD_ID: NDUC-15453; VALUE: 2.2uH
Q1 Q2 = Transistor:PMOSFET_: P-Channel MOSFET - Popular parts; CATEGORY: Transistor; DESCRIPTION: MOSFET P-CH 30V 3A SOT-23; DRAIN_CURRENT: 3A; JLCPN: C22366440; MANUFACTURER: Infineon Technologies; MPN: IRLML5203TRPBF; OPERATING_TEMP: -55°C ~ 150°C; PART_STATUS: Active; ROHS_COMPLIANT: Yes; SUB-CATEGORY: MOSFET; THERMALLOSS: 1.25W; TYPE: P-Channel; VALUE: IRLML5203
R1-R9 R11-R13 R16 R18 R19 R23-R27 = rcl:R-US_: RESISTOR, American symbol; SPICEPREFIX: R
R10 R22 = rcl:R-US_: RESISTOR, American symbol; JLCPN: C2758291; SPICEPREFIX: R
R14 = rcl:R-US_: RESISTOR, American symbol; JLCPN: C110776; SPICEPREFIX: R
R15 = rcl:R-US_: RESISTOR, American symbol; JLCPN: C374583; SPICEPREFIX: R
R17 = rcl:R-US_: RESISTOR, American symbol; JLCPN: C224602; SPICEPREFIX: R
R20 R21 = rcl:R-US_: RESISTOR, American symbol; JLCPN: C304418; SPICEPREFIX: R
SV1-SV3 = con-lstb:MA03-2: PIN HEADER; OC_FARNELL: unknown; OC_NEWARK: unknown
SW1 SW2 = MSK-12C02:MSK-12C02_SMD_SPDT_SWITCH: Footprint of the VIMEX MSK-12C02 SPDT SMD Switch Created by mzst on 17-Jan-2016; JLCPN: C431540
U1 = SnapEDA Library:RP2040; MANUFACTURER: Raspberry Pi; MAXIMUM_PACKAGE_HEIGHT: 0.9 mm; PARTREV: 1.6.1; STANDARD: IPC 7351B
U2 = SnapEDA Library:W25Q64JVSSIQ: None; JLCPN: C97521; MANUFACTURER: Winbond Electronics; PACKAGE: SOIC127P790X216-8N
U3 = SnapEDA Library:74LVC4245APW: Octal dual supply translating transceiver; MPN: 74LVC4245APW; OC_FARNELL: 1631648; OC_NEWARK: 03P2784; PACKAGE: TSSOP-24; SUPPLIER: NXP
U4 = TP4056:TP4056: Complete single cell Li-Ion battery with a constant current / constant voltage linear charger Check availability <https://pricing.snapeda.com/parts/TP4056/NanJing%20Top%20Power%20ASIC%20Corp./view-part?ref=eda>; AVAILABILITY: Not in stock; CHECK_PRICES: https://www.snapeda.com/parts/TP4056/NanJing+Top+Power+ASIC+Corp./view-part/?ref=eda; DESCRIPTION: Complete single cell Li-Ion battery with a constant current / constant voltage linear charger; JLCPN: C725790; MF: NanJing Top Power ASIC Corp.; MP: TP4056; PACKAGE: Package; PRICE: None; SNAPEDA_LINK: https://www.snapeda.com/parts/TP4056/NanJing+Top+Power+ASIC+Corp./view-part/?ref=snap
U5 = MT3608:MT3608: High Efficiency 1.2MHz 2A Step Up Converter Check availability <https://pricing.snapeda.com/parts/MT3608/Aerosemi%20Technology%20Co.%2C%20Ltd/view-part?ref=eda>; AVAILABILITY: Not in stock; CHECK_PRICES: https://www.snapeda.com/parts/MT3608/Aerosemi+Technology+Co.%252C+Ltd/view-part/?ref=eda; DESCRIPTION: High Efficiency 1.2MHz 2A Step Up Converter; JLCPN: C84817; MF: Aerosemi Technology Co., Ltd; MP: MT3608; PACKAGE: Package; PRICE: None; SNAPEDA_LINK: https://www.snapeda.com/parts/MT3608/Aerosemi+Technology+Co.%252C+Ltd/view-part/?ref=snap
U6 = LIS3DHTR:LIS3DHTR: MEMS digital output motion sensor ultra low-power high performance 3-axes "nano" accelerometer Check availability <https://pricing.snapeda.com/parts/LIS3DHTR/STMicroelectronics/view-part?ref=eda>; AVAILABILITY: In Stock; CHECK_PRICES: https://www.snapeda.com/parts/LIS3DHTR/STMicroelectronics/view-part/?ref=eda; DESCRIPTION: Accelerometer X, Y, Z Axis ±2g, 4g, 8g, 16g 0.5Hz ~ 625Hz 16-LGA (3x3); JLCPN: C15134; MF: STMicroelectronics; MP: LIS3DHTR; PACKAGE: LGA-16 STMicroelectronics; PRICE: None; PURCHASE-URL: https://www.snapeda.com/api/url_track_click_mouser/?unipart_id=278195&manufacturer=STMicroelectronics&part_name=LIS3DHTR&search_term=None; SNAPEDA_LINK: https://www.snapeda.com/parts/LIS3DHTR/STMicroelectronics/view-part/?ref=snap
U12 = SnapEDA Library:LM321LVIDCKR; JLCPN: C484727
U$1 U$2 = Logos:CYCLESTARTV2
VR1 = IC_Power-Management:NCP1117ST33T3G: 1.0 A Low-Dropout Positive Fixed and Adjustable Voltage Regulators Datasheet <https://www.onsemi.com/pub/Collateral/NCP1117-D.PDF>; CATEGORY: IC_Power-Management; MANUFACTURER: ON Semiconductor; MPN: NCP1117ST33T3G; OPERATING_TEMP: 0 to +125 °C; PART_STATUS: Active; ROHS_COMPLIANT: RoHS3 Compliant; SERIES: NCP1117, NCV1117; SUB-CATEGORY: Voltage Regulator; TYPE: Linear
Y1 = Wurth_Quartz Crystals & Oscillators_WE-SPXO:WE-SPXO_IQXO-540: WE-SPXO Simple Packaged Quartz Oscillator Characteristics SMT models Hermetically sealed Frequencies between 3.6864 MHz and 125 MHz Maximum operating temperatures range:-40 °C to 85 °C Stabilities down to ± 25 ppm available Available supply voltages: 1.8 V, 3.3 V and 5 V Available output signal types: CMOS; HCMOS; HCMOS/TTL Applications Microprocessor Wireless Communication Devices Industrial Devices Real Time Clocks Wired Communication (e.g. Ethernet and USB) IoT Optical Network Audio and Multimedia Devices Test and Measurement Equipment Navigation and Locators <https://www.we-online.com/catalog/media/o135918v209%20Family_WE-SPXO.jpg> Details see: https://www.we-online.com/catalog/en/WE-SPXO Updated by Ella Wu, 2019-09-03 2019 (C) Wurth Elektronik; DATASHEET-URL: https://www.we-online.com/catalog/datasheet/830208214609.pdf; MOUNT: SMT; PART-NUMBER: 830208214609; STABILITY: 25ppm; V-SUPPLY: 3.3V; VALUE: 4.0MHz